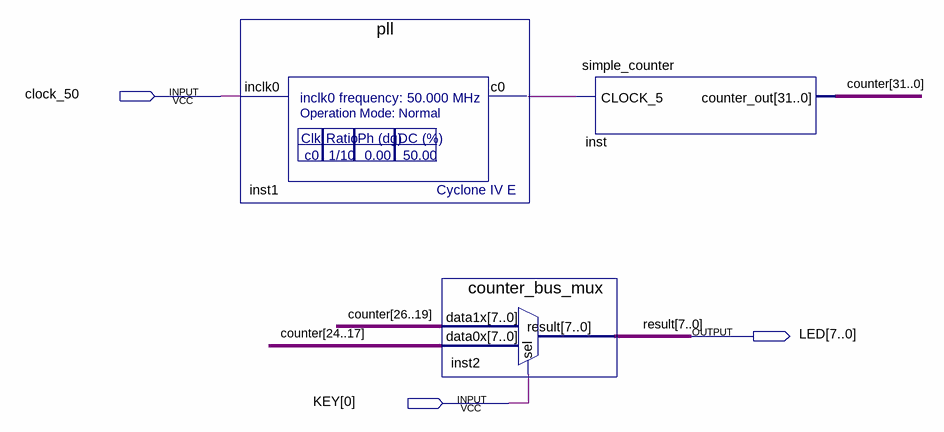
[diagram p0: schematic sheet]
// Quartus schematic my_first_fpga.bdf as structural Verilog: 3 symbols, 3 pins
module my_first_fpga (
  input  clock_50,
  input  [0:0] KEY,
  output [7:0] LED
);

  wire inst1_c0;
  wire [31:0] counter;

  pll inst1 (.inclk0(clock_50), .c0(inst1_c0));
  counter_bus_mux inst2 (.data1x(counter[26:19]), .data0x(counter[24:17]), .sel(KEY[0]), .result(LED));
  simple_counter inst (.CLOCK_5(inst1_c0), .counter_out(counter));

  // Other names for the same wires on the sheet: result[7:0] = LED
endmodule
